# EAGLE design Button_Sequencer (EAGLE 9.3.0)
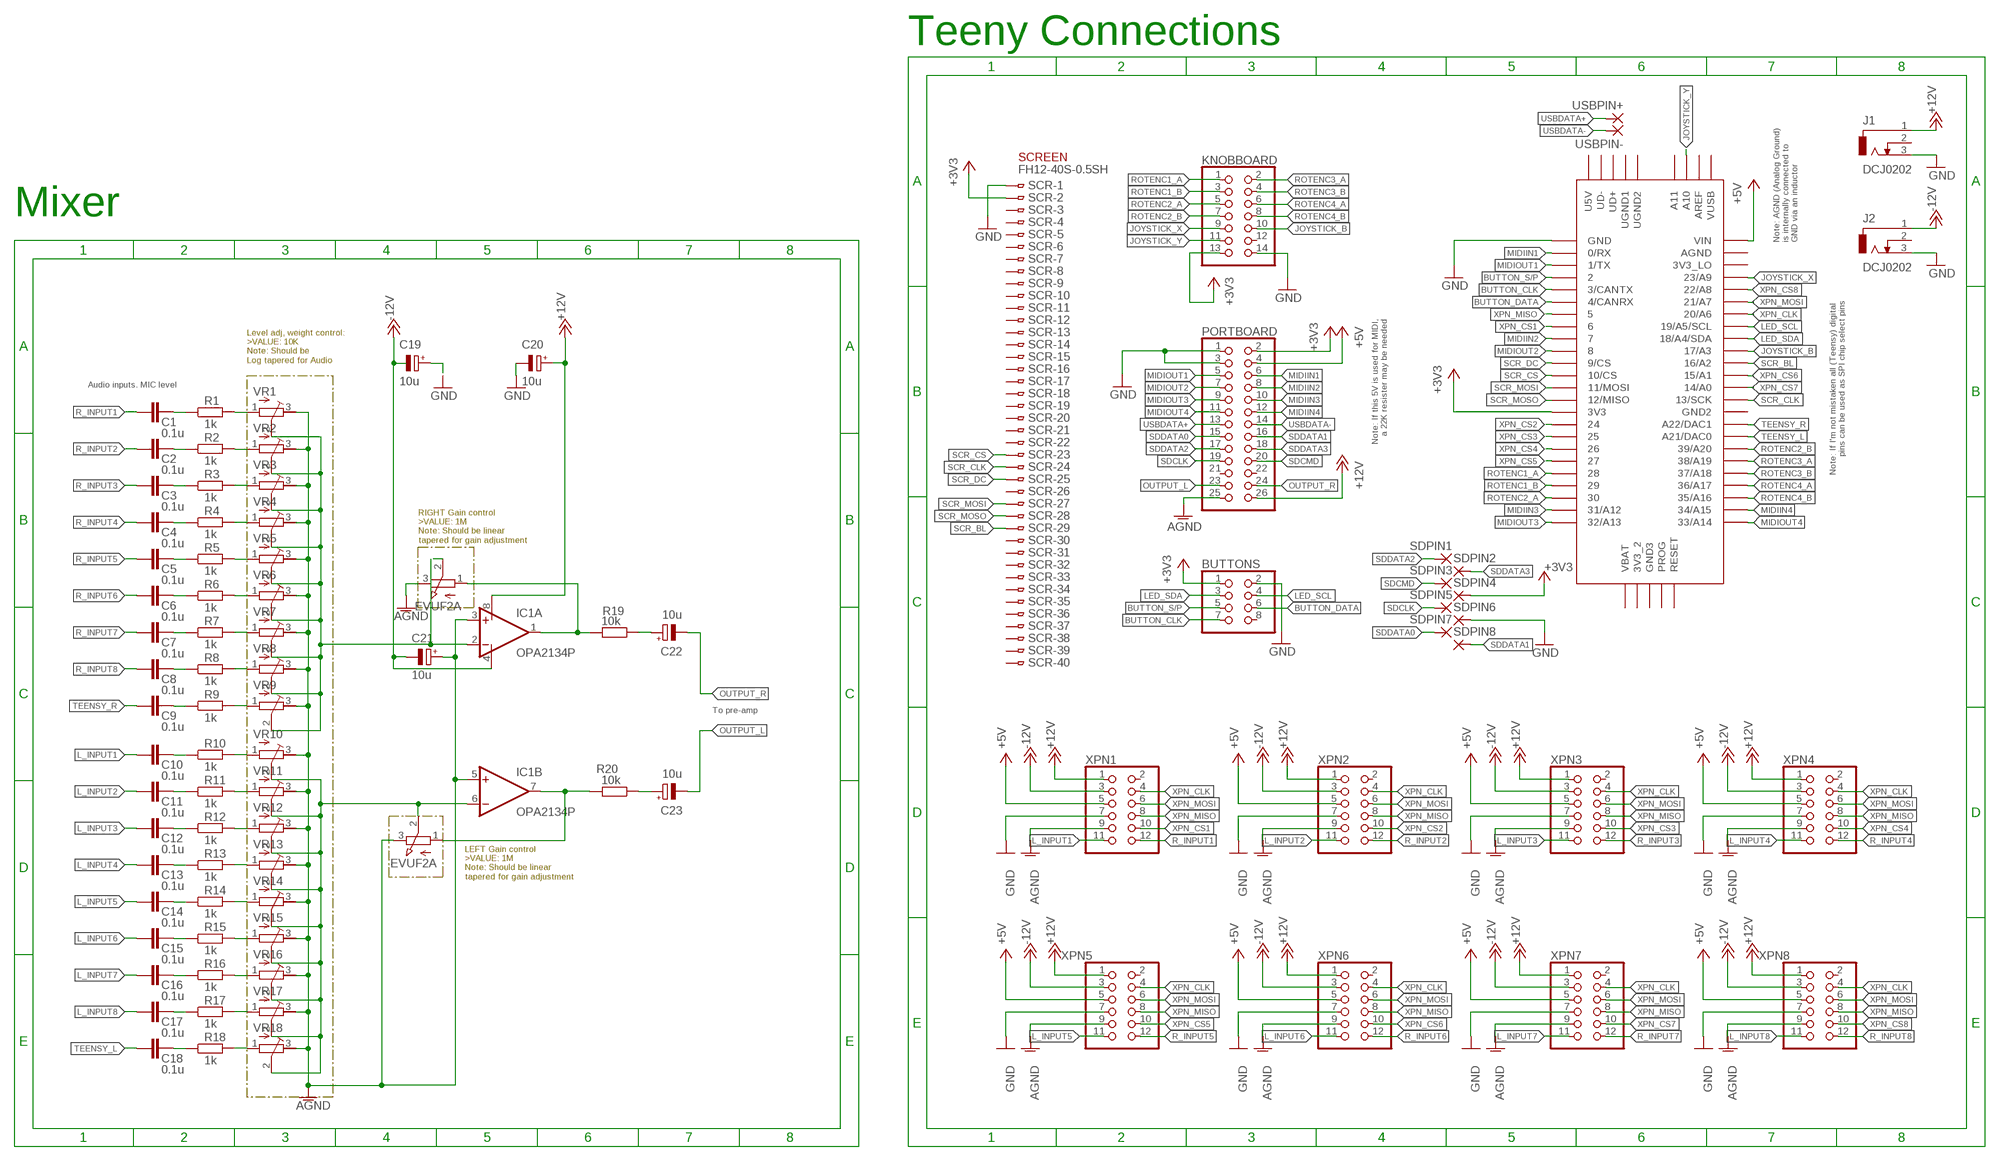
[diagram p0: schematic, sheet 1]

## Parts
BUTTONS  PINHD-2X4  [2X04]
C1  0.1u  C-EU025-030X050  [C025-030X050]
C2  0.1u  C-EU025-030X050  [C025-030X050]
C3  0.1u  C-EU025-030X050  [C025-030X050]
C4  0.1u  C-EU025-030X050  [C025-030X050]
C5  0.1u  C-EU025-030X050  [C025-030X050]
C6  0.1u  C-EU025-030X050  [C025-030X050]
C7  0.1u  C-EU025-030X050  [C025-030X050]
C8  0.1u  C-EU025-030X050  [C025-030X050]
C9  0.1u  C-EU025-030X050  [C025-030X050]
C10  0.1u  C-EU025-030X050  [C025-030X050]
C11  0.1u  C-EU025-030X050  [C025-030X050]
C12  0.1u  C-EU025-030X050  [C025-030X050]
C13  0.1u  C-EU025-030X050  [C025-030X050]
C14  0.1u  C-EU025-030X050  [C025-030X050]
C15  0.1u  C-EU025-030X050  [C025-030X050]
C16  0.1u  C-EU025-030X050  [C025-030X050]
C17  0.1u  C-EU025-030X050  [C025-030X050]
C18  0.1u  C-EU025-030X050  [C025-030X050]
C19  10u  CPOL-EUE5-10.5  [E5-10,5]
C20  10u  CPOL-EUE5-10.5  [E5-10,5]
C21  10u  CPOL-EUE5-10.5  [E5-10,5]
C22  10u  CPOL-EUE5-10.5  [E5-10,5]
C23  10u  CPOL-EUE5-10.5  [E5-10,5]
IC1  OPA2134P  [DIL08]
J1  DCJ0202  [DCJ0202]
J2  DCJ0202  [DCJ0202]
KNOBBOARD  PINHD-2X7  [2X07]
PORTBOARD  PINHD-2X13  [2X13]
R1  1k  R-EU_R0805  [R0805]
R2  1k  R-EU_R0805  [R0805]
R3  1k  R-EU_R0805  [R0805]
R4  1k  R-EU_R0805  [R0805]
R5  1k  R-EU_R0805  [R0805]
R6  1k  R-EU_R0805  [R0805]
R7  1k  R-EU_R0805  [R0805]
R8  1k  R-EU_R0805  [R0805]
R9  1k  R-EU_R0805  [R0805]
R10  1k  R-EU_R0805  [R0805]
R11  1k  R-EU_R0805  [R0805]
R12  1k  R-EU_R0805  [R0805]
R13  1k  R-EU_R0805  [R0805]
R14  1k  R-EU_R0805  [R0805]
R15  1k  R-EU_R0805  [R0805]
R16  1k  R-EU_R0805  [R0805]
R17  1k  R-EU_R0805  [R0805]
R18  1k  R-EU_R0805  [R0805]
R19  10k  R-EU_R0805  [R0805]
R20  10k  R-EU_R0805  [R0805]
SCR  FH12-40S-0.5SH  [FH12-40S-0.5SH]
SDPIN1  1,6/0,8  [1,6/0,8]
SDPIN2  1,6/0,8  [1,6/0,8]
SDPIN3  1,6/0,8  [1,6/0,8]
SDPIN4  1,6/0,8  [1,6/0,8]
SDPIN5  1,6/0,8  [1,6/0,8]
SDPIN6  1,6/0,8  [1,6/0,8]
SDPIN7  1,6/0,8  [1,6/0,8]
SDPIN8  1,6/0,8  [1,6/0,8]
TEENSY_3.6  TEENSY_3.5/3.6  [TEENSY_3.5/3.6]
USBPIN+  1,6/0,8  [1,6/0,8]
USBPIN-  1,6/0,8  [1,6/0,8]
VR1  R-TRIMM3339P  [RTRIM3339P]
VR2  R-TRIMM3339P  [RTRIM3339P]
VR3  R-TRIMM3339P  [RTRIM3339P]
VR4  R-TRIMM3339P  [RTRIM3339P]
VR5  R-TRIMM3339P  [RTRIM3339P]
VR6  R-TRIMM3339P  [RTRIM3339P]
VR7  R-TRIMM3339P  [RTRIM3339P]
VR8  R-TRIMM3339P  [RTRIM3339P]
VR9  R-TRIMM3339P  [RTRIM3339P]
VR10  R-TRIMM3339P  [RTRIM3339P]
VR11  R-TRIMM3339P  [RTRIM3339P]
VR12  R-TRIMM3339P  [RTRIM3339P]
VR13  R-TRIMM3339P  [RTRIM3339P]
VR14  R-TRIMM3339P  [RTRIM3339P]
VR15  R-TRIMM3339P  [RTRIM3339P]
VR16  R-TRIMM3339P  [RTRIM3339P]
VR17  R-TRIMM3339P  [RTRIM3339P]
VR18  R-TRIMM3339P  [RTRIM3339P]
VR19  EVUF2A  [EVUF]
VR20  EVUF2A  [EVUF]
XPN1  PINHD-2X6  [2X06]
XPN2  PINHD-2X6  [2X06]
XPN3  PINHD-2X6  [2X06]
XPN4  PINHD-2X6  [2X06]
XPN5  PINHD-2X6  [2X06]
XPN6  PINHD-2X6  [2X06]
XPN7  PINHD-2X6  [2X06]
XPN8  PINHD-2X6  [2X06]

## Nets
+3V3: BUTTONS.1 KNOBBOARD.13 PORTBOARD.2 SCR.2 SDPIN4.1(P) TEENSY_3.6.3V3
+5V: PORTBOARD.4 TEENSY_3.6.VIN XPN1.5 XPN2.5 XPN3.5 XPN4.5 XPN5.5 XPN6.5 XPN7.5 XPN8.5
+12V: C20.+ IC1.8(P:V+) J1.1 PORTBOARD.26 XPN1.1 XPN2.1 XPN3.1 XPN4.1 XPN5.1 XPN6.1 XPN7.1 XPN8.1
-12V: C19.- C21.- IC1.4(P:V-) J2.1 XPN1.3 XPN2.3 XPN3.3 XPN4.3 XPN5.3 XPN6.3 XPN7.3 XPN8.3
AGND: C21.+ IC1.3(A:+IN) IC1.5(B:+IN) PORTBOARD.25 VR1.3(E) VR2.3(E) VR3.3(E) VR4.3(E) VR5.3(E) VR6.3(E) VR7.3(E) VR8.3(E) VR9.3(E) VR10.3(E) VR11.3(E) VR12.3(E) VR13.3(E) VR14.3(E) VR15.3(E) VR16.3(E) VR17.3(E) VR18.3(E) VR19.3(E) VR20.3(E) XPN1.9 XPN2.9 XPN3.9 XPN4.9 XPN5.9 XPN6.9 XPN7.9 XPN8.9
BUTTON_CLK: BUTTONS.7 TEENSY_3.6.3/CANTX
BUTTON_DATA: BUTTONS.6 TEENSY_3.6.4/CANRX
BUTTON_S/P: BUTTONS.5 TEENSY_3.6.2
GND: BUTTONS.2 C19.+ C20.- J1.3 J2.3 KNOBBOARD.14 PORTBOARD.1 PORTBOARD.3 SCR.1 SDPIN6.1(P) TEENSY_3.6.GND XPN1.7 XPN2.7 XPN3.7 XPN4.7 XPN5.7 XPN6.7 XPN7.7 XPN8.7
JOYSTICK_B: KNOBBOARD.10 TEENSY_3.6.17/A3
JOYSTICK_X: KNOBBOARD.9 TEENSY_3.6.23/A9
JOYSTICK_Y: KNOBBOARD.11 TEENSY_3.6.A10
L_INPUT1: C10.2 XPN1.11
L_INPUT2: C11.2 XPN2.11
L_INPUT3: C12.2 XPN3.11
L_INPUT4: C13.2 XPN4.11
L_INPUT5: C14.2 XPN5.11
L_INPUT6: C15.2 XPN6.11
L_INPUT7: C16.2 XPN7.11
L_INPUT8: C17.2 XPN8.11
L_OP_IN: IC1.6(B:-IN) VR10.2(S) VR11.2(S) VR12.2(S) VR13.2(S) VR14.2(S) VR15.2(S) VR16.2(S) VR17.2(S) VR18.2(S) VR20.2(S)
LED_SCL: BUTTONS.4 TEENSY_3.6.19/A5/SCL
LED_SDA: BUTTONS.3 TEENSY_3.6.18/A4/SDA
LEFT_OP_OUT: IC1.7(B:OUT) R20.2 VR20.1(A)
MIDIIN1: PORTBOARD.6 TEENSY_3.6.0/RX
MIDIIN2: PORTBOARD.8 TEENSY_3.6.7
MIDIIN3: PORTBOARD.10 TEENSY_3.6.31/A12
MIDIIN4: PORTBOARD.12 TEENSY_3.6.34/A15
MIDIOUT1: PORTBOARD.5 TEENSY_3.6.1/TX
MIDIOUT2: PORTBOARD.7 TEENSY_3.6.8
MIDIOUT3: PORTBOARD.9 TEENSY_3.6.32/A13
MIDIOUT4: PORTBOARD.11 TEENSY_3.6.33/A14
N$1: C4.1 R4.1
N$2: C22.+ R19.1
N$3: C1.1 R1.1
N$4: C2.1 R2.1
N$5: C3.1 R3.1
N$6: C9.1 R9.1
N$7: R9.2 VR9.1(A)
N$8: C10.1 R10.1
N$9: R10.2 VR10.1(A)
N$10: R3.2 VR3.1(A)
N$11: C11.1 R11.1
N$13: R1.2 VR1.1(A)
N$14: R4.2 VR4.1(A)
N$15: C12.1 R12.1
N$16: C13.1 R13.1
N$17: R13.2 VR13.1(A)
N$18: R2.2 VR2.1(A)
N$20: C23.+ R20.1
N$21: R11.2 VR11.1(A)
N$23: R12.2 VR12.1(A)
N$25: C5.1 R5.1
N$26: C6.1 R6.1
N$27: C7.1 R7.1
N$28: R7.2 VR7.1(A)
N$29: R5.2 VR5.1(A)
N$30: R6.2 VR6.1(A)
N$31: C8.1 R8.1
N$32: R8.2 VR8.1(A)
N$35: C14.1 R14.1
N$36: R14.2 VR14.1(A)
N$39: C15.1 R15.1
N$40: C16.1 R16.1
N$41: C17.1 R17.1
N$42: R17.2 VR17.1(A)
N$43: R15.2 VR15.1(A)
N$44: R16.2 VR16.1(A)
N$45: C18.1 R18.1
N$46: R18.2 VR18.1(A)
OUTPUT_L: C23.- PORTBOARD.23
OUTPUT_R: C22.- PORTBOARD.24
R_INPUT1: C1.2 XPN1.12
R_INPUT2: C2.2 XPN2.12
R_INPUT3: C3.2 XPN3.12
R_INPUT4: C4.2 XPN4.12
R_INPUT5: C5.2 XPN5.12
R_INPUT6: C6.2 XPN6.12
R_INPUT7: C7.2 XPN7.12
R_INPUT8: C8.2 XPN8.12
R_OP_IN: IC1.2(A:-IN) VR1.2(S) VR2.2(S) VR3.2(S) VR4.2(S) VR5.2(S) VR6.2(S) VR7.2(S) VR8.2(S) VR9.2(S) VR19.2(S)
RIGHT_OP_OUT: IC1.1(A:OUT) R19.2 VR19.1(A)
ROTENC1_A: KNOBBOARD.1 TEENSY_3.6.28
ROTENC1_B: KNOBBOARD.3 TEENSY_3.6.29
ROTENC2_A: KNOBBOARD.5 TEENSY_3.6.30
ROTENC2_B: KNOBBOARD.7 TEENSY_3.6.39/A20
ROTENC3_A: KNOBBOARD.2 TEENSY_3.6.38/A19
ROTENC3_B: KNOBBOARD.4 TEENSY_3.6.37/A18
ROTENC4_A: KNOBBOARD.6 TEENSY_3.6.36/A17
ROTENC4_B: KNOBBOARD.8 TEENSY_3.6.35/A16
SCR_BL: SCR.29 TEENSY_3.6.16/A2
SCR_CLK: SCR.24 TEENSY_3.6.13/SCK
SCR_CS: SCR.23 TEENSY_3.6.10/CS
SCR_DC: SCR.25 TEENSY_3.6.9/CS
SCR_MOSI: SCR.27 TEENSY_3.6.11/MOSI
SCR_MOSO: SCR.28 TEENSY_3.6.12/MISO
SDCLK: PORTBOARD.19 SDPIN5.1(P)
SDCMD: PORTBOARD.20 SDPIN3.1(P)
SDDATA0: PORTBOARD.15 SDPIN7.1(P)
SDDATA1: PORTBOARD.16 SDPIN8.1(P)
SDDATA2: PORTBOARD.17 SDPIN1.1(P)
SDDATA3: PORTBOARD.18 SDPIN2.1(P)
TEENSY_L: C18.2 TEENSY_3.6.21/DAC0(A21/DAC0)
TEENSY_R: C9.2 TEENSY_3.6.A22/DAC1
USBDATA+: PORTBOARD.13 USBPIN+.1(P)
USBDATA-: PORTBOARD.14 USBPIN-.1(P)
XPN_CLK: TEENSY_3.6.20/A6 XPN1.4 XPN2.4 XPN3.4 XPN4.4 XPN5.4 XPN6.4 XPN7.4 XPN8.4
XPN_CS1: TEENSY_3.6.6 XPN1.10
XPN_CS2: TEENSY_3.6.24 XPN2.10
XPN_CS3: TEENSY_3.6.25 XPN3.10
XPN_CS4: TEENSY_3.6.26 XPN4.10
XPN_CS5: TEENSY_3.6.27 XPN5.10
XPN_CS6: TEENSY_3.6.15/A1 XPN6.10
XPN_CS7: TEENSY_3.6.14/A0 XPN7.10
XPN_CS8: TEENSY_3.6.22/A8 XPN8.10
XPN_MISO: TEENSY_3.6.5 XPN1.8 XPN2.8 XPN3.8 XPN4.8 XPN5.8 XPN6.8 XPN7.8 XPN8.8
XPN_MOSI: TEENSY_3.6.21/A7 XPN1.6 XPN2.6 XPN3.6 XPN4.6 XPN5.6 XPN6.6 XPN7.6 XPN8.6
Unconnected: BUTTONS.8 J1.2 J2.2 KNOBBOARD.12 PORTBOARD.21 PORTBOARD.22 SCR.3 SCR.4 SCR.5 SCR.6 SCR.7 SCR.8 SCR.9 SCR.10 SCR.11 SCR.12 SCR.13 SCR.14 SCR.15 SCR.16 SCR.17 SCR.18 SCR.19 SCR.20 SCR.21 SCR.22 SCR.26 SCR.30 SCR.31 SCR.32 SCR.33 SCR.34 SCR.35 SCR.36 SCR.37 SCR.38 SCR.39 SCR.40 TEENSY_3.6.3V3_2 TEENSY_3.6.3V3_LO TEENSY_3.6.A11 TEENSY_3.6.AGND TEENSY_3.6.AREF TEENSY_3.6.GND2 TEENSY_3.6.GND3 TEENSY_3.6.PROG TEENSY_3.6.RESET TEENSY_3.6.U5V TEENSY_3.6.UD+ TEENSY_3.6.UD- TEENSY_3.6.UGND1 TEENSY_3.6.UGND2 TEENSY_3.6.VBAT TEENSY_3.6.VUSB XPN1.2 XPN2.2 XPN3.2 XPN4.2 XPN5.2 XPN6.2 XPN7.2 XPN8.2

## Notes on the sheet
- Teeny Connections
- SCREEN
- Mixer
- Note: AGND (Analog Ground) 
  is internally connected to 
  GND via an inductor
- Note: If I'm not mistaken all (Teensy) digital 
  pins can be used as SPI chip select pins
- Note: If this 5V is used for MIDI,
  a 22K resister may be needed
- Level adj, weight control:
  >VALUE: 10K
  Note: Should be
  Log tapered for Audio
- Audio inputs. MIC level
- RIGHT Gain control
  >VALUE: 1M
  Note: Should be linear
  tapered for gain adjustment
- To pre-amp
- LEFT Gain control
  >VALUE: 1M
  Note: Should be linear
  tapered for gain adjustment

## Library data of the parts
BUTTONS = pinhead:PINHD-2X4: PIN HEADER
C1-C18 = rcl:C-EU: CAPACITOR, European symbol; SPICEPREFIX: C
C19-C23 = rcl:CPOL-EU: POLARIZED CAPACITOR, European symbol; SPICEPREFIX: C
IC1 = linear:OPA2134: SoundPLUS (TM) High Performance AUDIO OPERATIONAL AMPLIFIERS Source: http://focus.ti.com/lit/ds/sbos058/sbos058.pdf
J1 J2 = con-jack:DCJ0202: DC POWER JACK Source: DCJ0202.pdf; OC_FARNELL: unknown; OC_NEWARK: unknown
KNOBBOARD = pinhead:PINHD-2X7: PIN HEADER
PORTBOARD = pinhead:PINHD-2X13: PIN HEADER
R1-R20 = rcl:R-EU_: RESISTOR, European symbol; SPICEPREFIX: R
SCR = con-hirose:FH12-40S-0.5S: 0.5mm Pitch Connectors For FPC/FFC Source: Data sheet <http://www.hirose.co.jp/cataloge_hp/e58605370.pdf>; MPN: FH12-40S-0.5SH(55); OC_FARNELL: 1324556; OC_NEWARK: 34M6178
SDPIN1-SDPIN8 USBPIN+ USBPIN- = wirepad:1,6/0,8: THROUGH-HOLE PAD
TEENSY_3.6 = Teensy356:TEENSY_3.5/3.6
VR1-VR18 = rcl:R-TRIMM: Trimm resistor; SPICEMODEL: X; SPICEPREFIXL: POT
VR19 VR20 = pot:EVU: 9 mm Square Rotary Potentiometers Source: Panasonic
XPN1-XPN8 = pinhead:PINHD-2X6: PIN HEADER

## Board
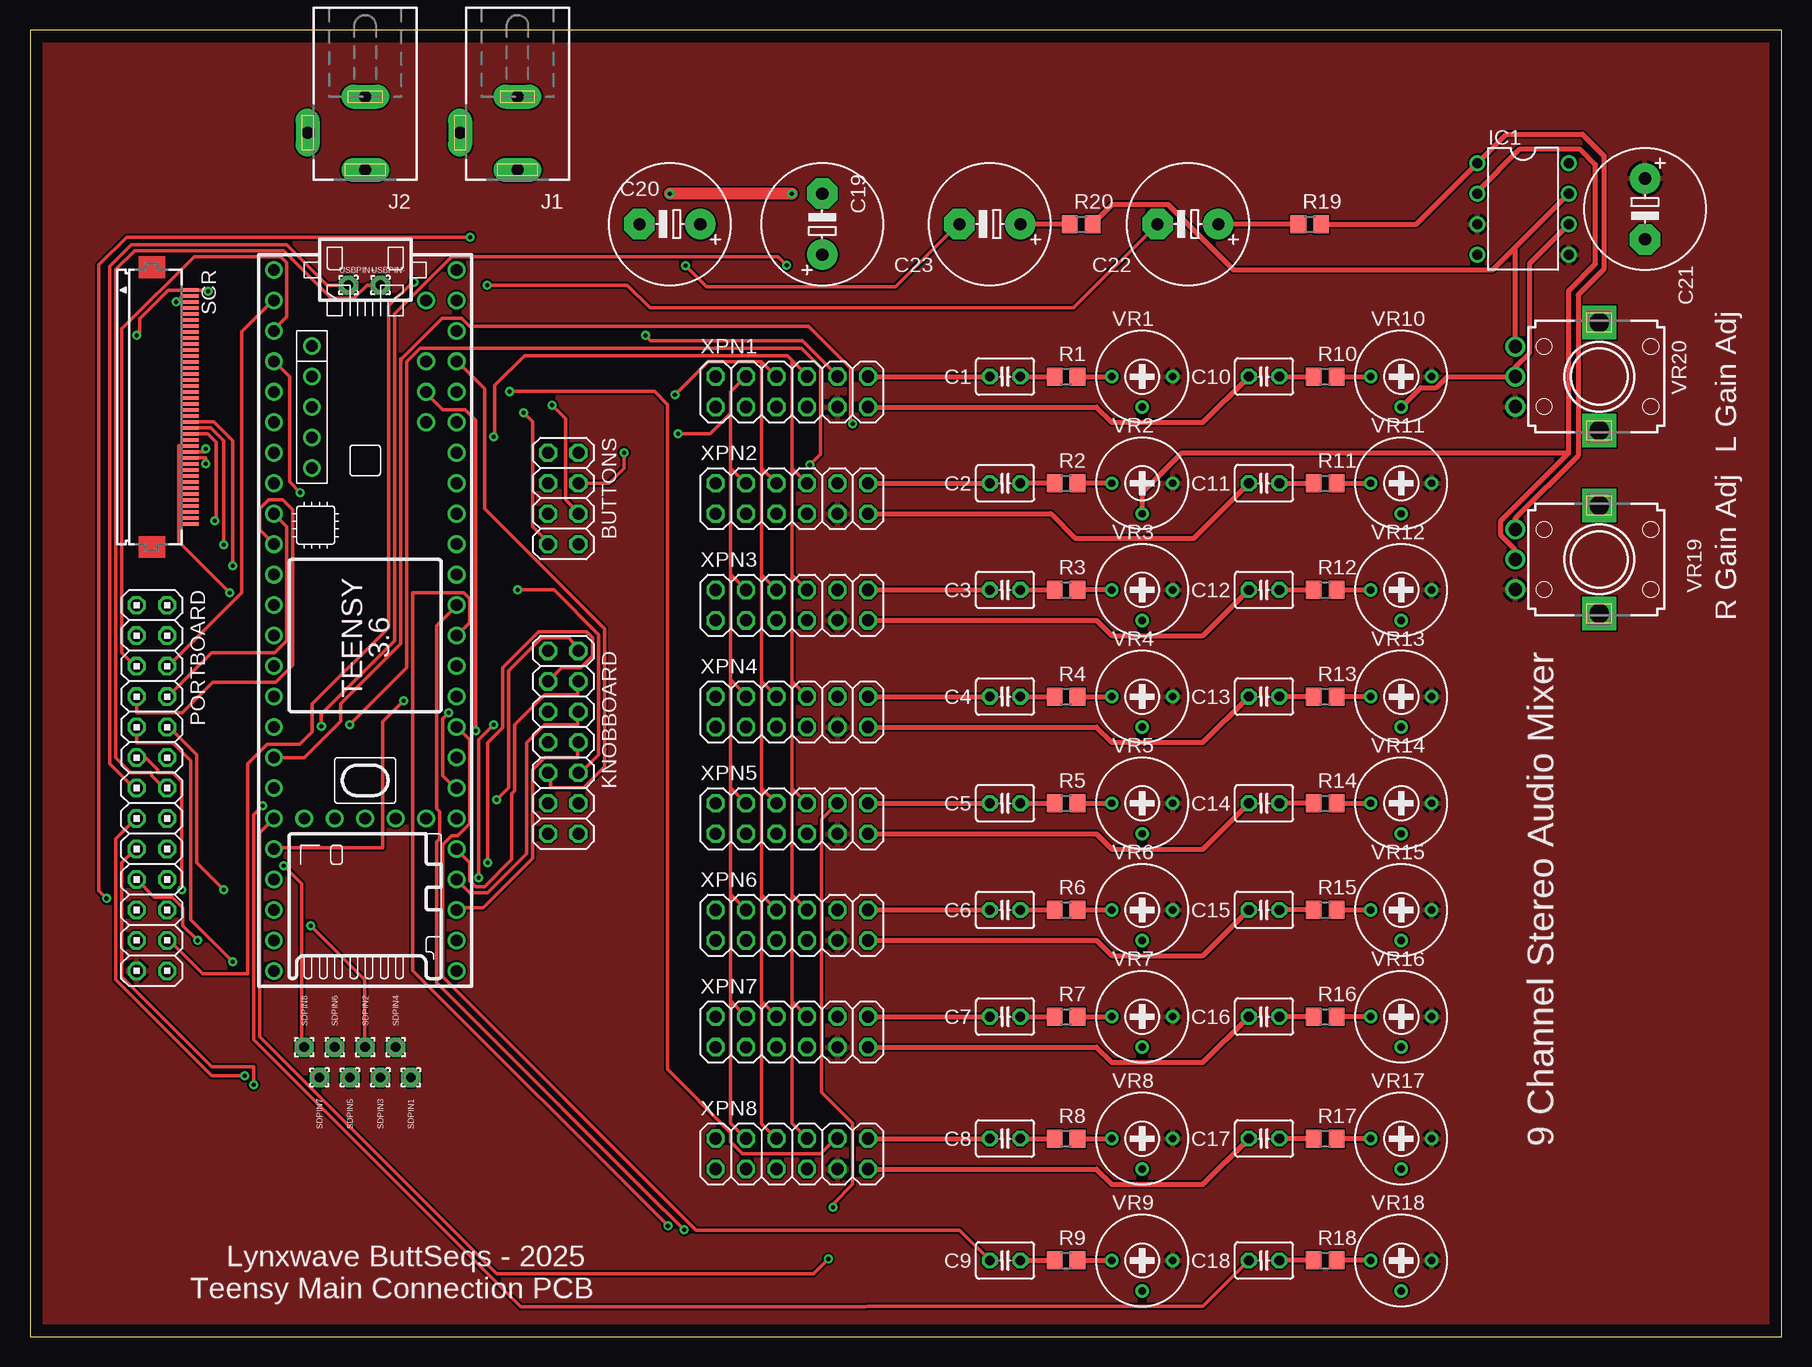
[diagram p1: board, top side]
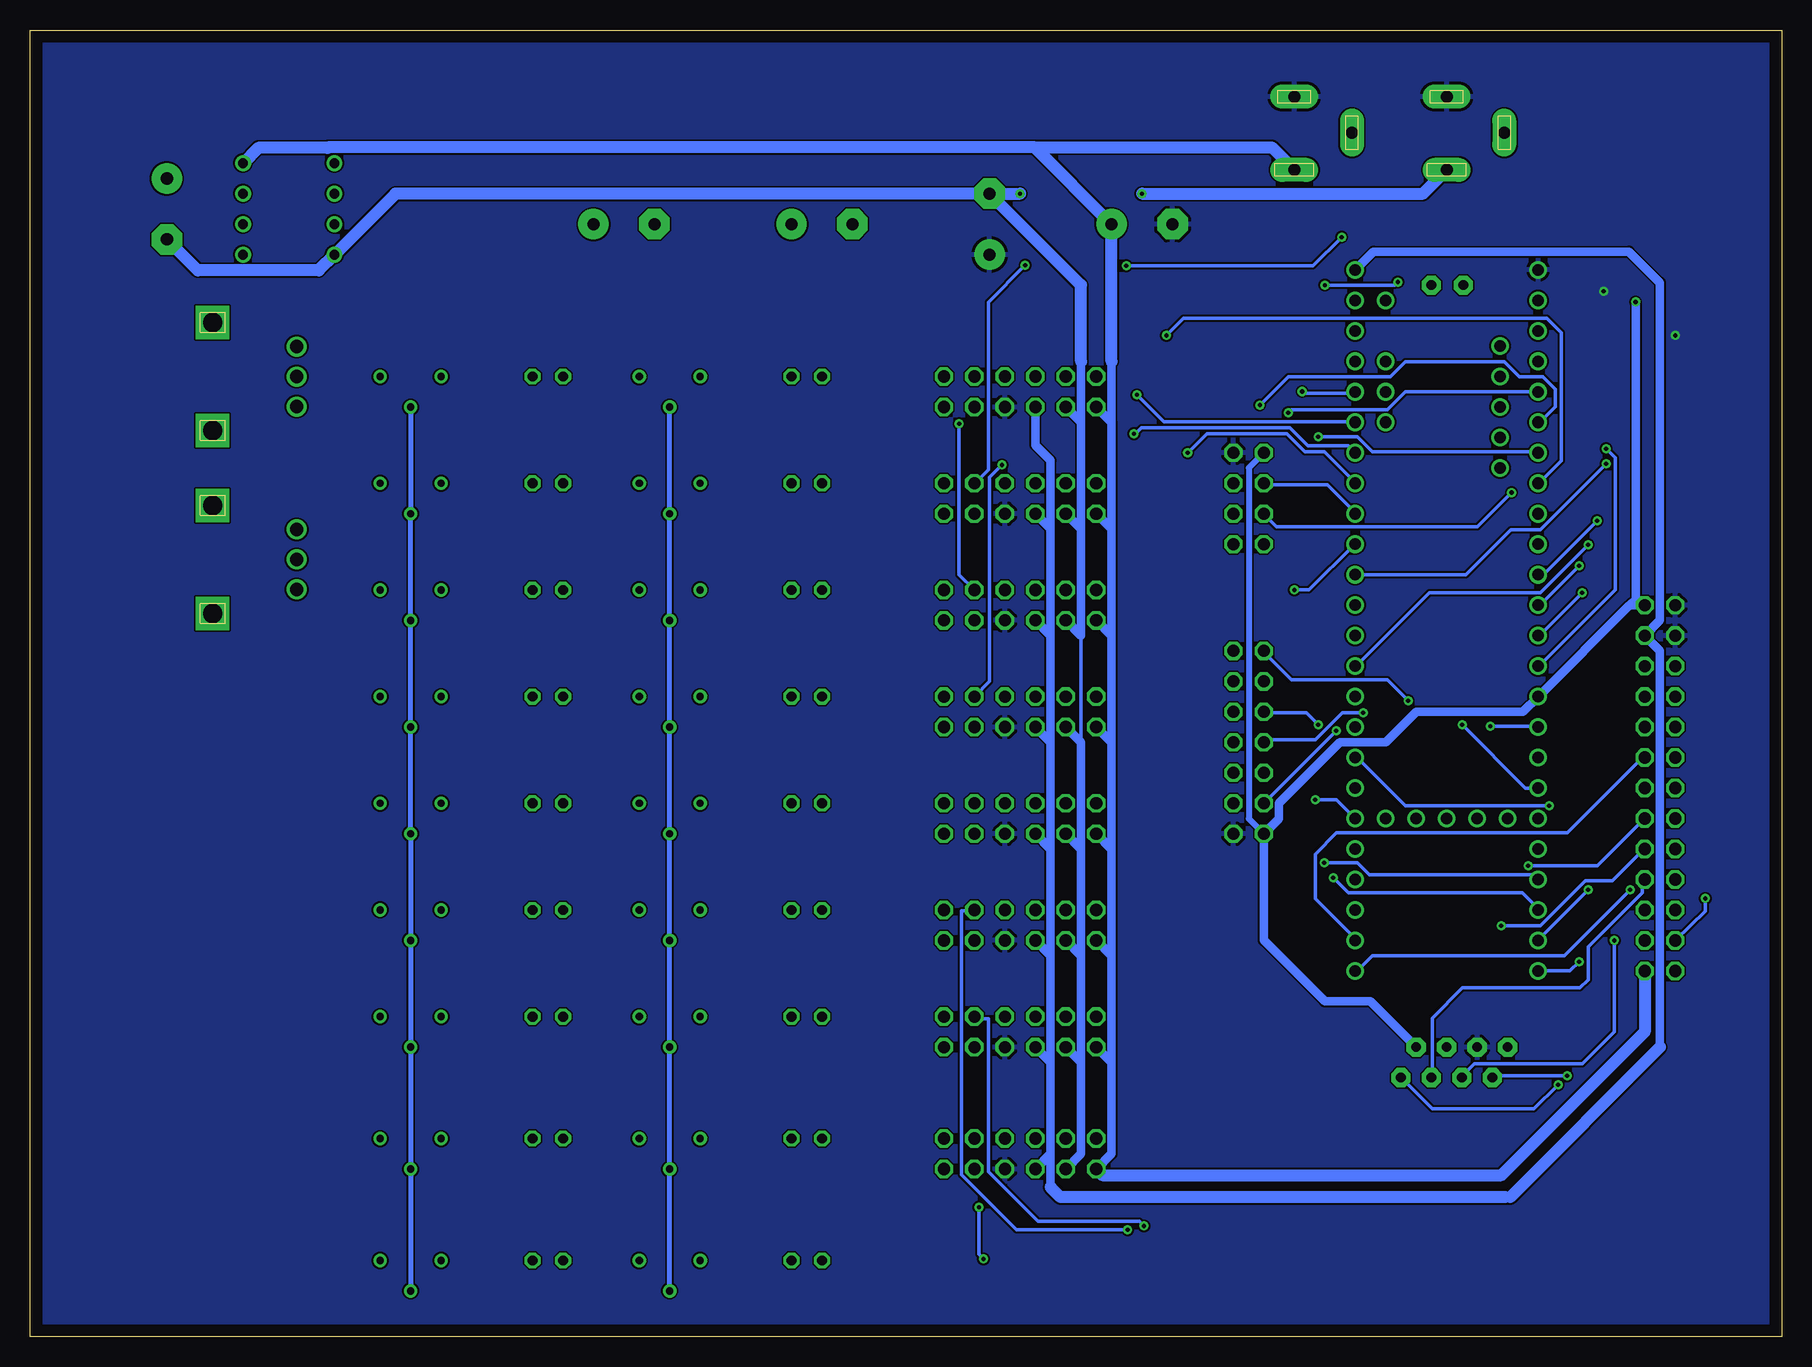
[diagram p2: board, bottom side, seen from below]

Size 146.03 x 108.89 mm. Coordinates in mm from the lower left corner, seen from the top.
Outline: 0,0 146.03,0 146.03,108.89 0,108.89 0,0
Copper layers (1*16): Top 0.035mm / dielectric 1.5mm / Bottom 0.035mm
Design rules "default *": minimum track width 0.3mm, minimum drill 0.35mm, track to track 6mil, track to pad 6mil, pad to pad 6mil, via to via 6mil, smd to smd 6mil, copper to edge 40mil, drill to drill 6mil, minimum pad ring 10mil, minimum via ring 8mil, stop-mask expansion 4mil, vias tented up to drill 0mil, thermal gap 10mil

### Footprints (pad centres in the part's own frame; a part is rotated, then mirrored left to right if it is on the bottom)
2X04 = drill 1.016 octagon: 1 -3.81,-1.27; 2 -3.81,1.27; 3 -1.27,-1.27; 4 -1.27,1.27; 5 1.27,-1.27; 6 1.27,1.27; 7 3.81,-1.27; 8 3.81,1.27
C025-030X050 = drill 0.813 octagon: 1 -1.27,0; 2 1.27,0
E5-10,5 = drill 1.016 pad 2.54: + -2.54,0 | drill 1.016 pad 2.54 octagon: - 2.54,0
DIL08 = drill 0.813 pad 1.27: 1 -3.81,-3.81; 2 -1.27,-3.81; 3 1.27,-3.81; 4 3.81,-3.81; 5 3.81,3.81; 6 1.27,3.81; 7 -1.27,3.81; 8 -3.81,3.81
DCJ0202 = drill 1 pad 2 long: 1 0,3.1; 2 4.8,0; 3 0,-3
2X07 = drill 1.016 octagon: 1 -7.62,-1.27; 2 -7.62,1.27; 3 -5.08,-1.27; 4 -5.08,1.27; 5 -2.54,-1.27; 6 -2.54,1.27; 7 0,-1.27; 8 0,1.27; 9 2.54,-1.27; 10 2.54,1.27; 11 5.08,-1.27; 12 5.08,1.27; 13 7.62,-1.27; 14 7.62,1.27
2X13 = drill 1.016 octagon: 1 -15.24,-1.27; 2 -15.24,1.27; 3 -12.7,-1.27; 4 -12.7,1.27; 5 -10.16,-1.27; 6 -10.16,1.27; 7 -7.62,-1.27; 8 -7.62,1.27; 9 -5.08,-1.27; 10 -5.08,1.27; 11 -2.54,-1.27; 12 -2.54,1.27; 13 0,-1.27; 14 0,1.27; 15 2.54,-1.27; 16 2.54,1.27; 17 5.08,-1.27; 18 5.08,1.27; 19 7.62,-1.27; 20 7.62,1.27; 21 10.16,-1.27; 22 10.16,1.27; 23 12.7,-1.27; 24 12.7,1.27; 25 15.24,-1.27; 26 15.24,1.27
R0805 = smd 1.3 x 1.5: 1 -0.95,0; 2 0.95,0
FH12-40S-0.5SH = smd 0.3 x 1.3: 1 -9.75,3.25; 2 -9.25,3.25; 3 -8.75,3.25; 4 -8.25,3.25; 5 -7.75,3.25; 6 -7.25,3.25; 7 -6.75,3.25; 8 -6.25,3.25; 9 -5.75,3.25; 10 -5.25,3.25; 11 -4.75,3.25; 12 -4.25,3.25; 13 -3.75,3.25; 14 -3.25,3.25; 15 -2.75,3.25; 16 -2.25,3.25; 17 -1.75,3.25; 18 -1.25,3.25; 19 -0.75,3.25; 20 -0.25,3.25; 21 0.25,3.25; 22 0.75,3.25; 23 1.25,3.25; 24 1.75,3.25; 25 2.25,3.25; 26 2.75,3.25; 27 3.25,3.25; 28 3.75,3.25; 29 4.25,3.25; 30 4.75,3.25; 31 5.25,3.25; 32 5.75,3.25; 33 6.25,3.25; 34 6.75,3.25; 35 7.25,3.25; 36 7.75,3.25; 37 8.25,3.25; 38 8.75,3.25; 39 9.25,3.25; 40 9.75,3.25
1,6/0,8 = drill 0.813 pad 1.6 octagon: 1 0,0
TEENSY_3.5/3.6 = drill 0.965: 0/RX -25.4,-7.62; 1/TX -22.86,-7.62; 2 -20.32,-7.62; 3/CANTX -17.78,-7.62; 3V3 7.62,-7.62; 3V3_2 17.78,-2.54; 3V3_LO -22.86,7.62; 4/CANRX -15.24,-7.62; 5 -12.7,-7.62; 6 -10.16,-7.62; 7 -7.62,-7.62; 8 -5.08,-7.62; 9/CS -2.54,-7.62; 10/CS 0,-7.62; 11/MOSI 2.54,-7.62; 12/MISO 5.08,-7.62; 13/SCK 5.08,7.62; 14/A0 2.54,7.62; 15/A1 0,7.62; 16/A2 -2.54,7.62; 17/A3 -5.08,7.62; 18/A4/SDA -7.62,7.62; 19/A5/SCL -10.16,7.62; 20/A6 -12.7,7.62; 21/A7 -15.24,7.62; 21/DAC0 12.7,7.62; 22/A8 -17.78,7.62; 23/A9 -20.32,7.62; 24 10.16,-7.62; 25 12.7,-7.62; 26 15.24,-7.62; 27 17.78,-7.62; 28 20.32,-7.62; 29 22.86,-7.62; 30 25.4,-7.62; 31/A12 27.94,-7.62; 32/A13 30.48,-7.62; 33/A14 30.48,7.62; 34/A15 27.94,7.62; 35/A16 25.4,7.62; 36/A17 22.86,7.62; 37/A18 20.32,7.62; 38/A19 17.78,7.62; 39/A20 15.24,7.62; A10 -17.78,5.08; A11 -15.24,5.08; A22/DAC1 10.16,7.62; AGND -25.4,7.62; AREF -20.32,5.08; GND -27.94,-7.62; GND2 7.62,7.62; GND3 17.78,0; PROG 17.78,2.54; RESET 17.78,5.08; U5V -21.59,-4.445; UD+ -16.51,-4.445; UD- -19.05,-4.445; UGND1 -13.97,-4.445; UGND2 -11.43,-4.445; VBAT 17.78,-5.08; VIN -27.94,7.62; VUSB -25.4,5.08
RTRIM3339P = drill 0.61: 1 -2.54,0; 2 0,-2.54; 3 2.54,0
EVUF = drill 1.1 pad 1.676: 1 -2.5,-7; 2 0,-7; 3 2.5,-7 | drill 1.6 pad 2.8 square: M1 4.5,0; M2 -4.5,0
2X06 = drill 1.016 octagon: 1 -6.35,-1.27; 2 -6.35,1.27; 3 -3.81,-1.27; 4 -3.81,1.27; 5 -1.27,-1.27; 6 -1.27,1.27; 7 1.27,-1.27; 8 1.27,1.27; 9 3.81,-1.27; 10 3.81,1.27; 11 6.35,-1.27; 12 6.35,1.27

### Placement (x,y rotation side)
BUTTONS  44.45,69.85 270 top
C1  81.28,80.01 180 top
C2  81.28,71.12 180 top
C3  81.28,62.23 180 top
C4  81.28,53.34 180 top
C5  81.28,44.45 180 top
C6  81.28,35.56 180 top
C7  81.28,26.67 180 top
C8  81.28,16.51 180 top
C9  81.28,6.35 180 top
C10  102.87,80.01 180 top
C11  102.87,71.12 180 top
C12  102.87,62.23 180 top
C13  102.87,53.34 180 top
C14  102.87,44.45 180 top
C15  102.87,35.56 180 top
C16  102.87,26.67 180 top
C17  102.87,16.51 180 top
C18  102.87,6.35 180 top
C19  66.04,92.71 90 top
C20  53.34,92.71 180 top
C21  134.62,93.98 270 top
C22  96.52,92.71 180 top
C23  80.01,92.71 180 top
IC1  124.46,93.98 270 top
J1  40.64,100.33 180 top
J2  27.94,100.33 180 top
KNOBBOARD  44.45,49.53 270 top
PORTBOARD  10.16,45.72 270 top
R1  86.36,80.01 0 top
R2  86.36,71.12 0 top
R3  86.36,62.23 0 top
R4  86.36,53.34 0 top
R5  86.36,44.45 0 top
R6  86.36,35.56 0 top
R7  86.36,26.67 0 top
R8  86.36,16.51 0 top
R9  86.36,6.35 0 top
R10  107.95,80.01 0 top
R11  107.95,71.12 0 top
R12  107.95,62.23 0 top
R13  107.95,53.34 0 top
R14  107.95,44.45 0 top
R15  107.95,35.56 0 top
R16  107.95,26.67 0 top
R17  107.95,16.51 0 top
R18  107.95,6.35 0 top
R19  106.68,92.71 0 top
R20  87.63,92.71 0 top
SCR  10.16,77.47 270 top
SDPIN1  31.75,21.59 270 top
SDPIN2  27.94,24.13 90 top
SDPIN3  29.21,21.59 270 top
SDPIN4  30.48,24.13 90 top
SDPIN5  26.67,21.59 270 top
SDPIN6  25.4,24.13 90 top
SDPIN7  24.13,21.59 270 top
SDPIN8  22.86,24.13 90 top
TEENSY_3.6  27.94,60.96 270 top
USBPIN+  26.54,87.63 0 top
USBPIN-  29.21,87.63 0 top
VR1  92.71,80.01 0 top
VR2  92.71,71.12 0 top
VR3  92.71,62.23 0 top
VR4  92.71,53.34 0 top
VR5  92.71,44.45 0 top
VR6  92.71,35.56 0 top
VR7  92.71,26.67 0 top
VR8  92.71,16.51 0 top
VR9  92.71,6.35 0 top
VR10  114.3,80.01 0 top
VR11  114.3,71.12 0 top
VR12  114.3,62.23 0 top
VR13  114.3,53.34 0 top
VR14  114.3,44.45 0 top
VR15  114.3,35.56 0 top
VR16  114.3,26.67 0 top
VR17  114.3,16.51 0 top
VR18  114.3,6.35 0 top
VR19  130.81,64.77 270 top
VR20  130.81,80.01 270 top
XPN1  63.5,78.74 0 top
XPN2  63.5,69.85 0 top
XPN3  63.5,60.96 0 top
XPN4  63.5,52.07 0 top
XPN5  63.5,43.18 0 top
XPN6  63.5,34.29 0 top
XPN7  63.5,25.4 0 top
XPN8  63.5,15.24 0 top

### Tracks (layer width: path | path; a pad name or v marks a point on that pad's centre or on a via)
+3V3  (via drill 0.35)
  Top 0.3: SCR.2 12.7,86.72 | 12.7,86.72 12.68,86.72 | 12.7,86.72 12.65,86.67 12.63,86.67 v12.19,86.23
  Bottom 0.5: BUTTONS.1 44.44,72.4 44.44,43.17 KNOBBOARD.13
  Bottom 0.7: SDPIN4.1 34.29,27.94 38.1,27.94 43.18,33.02 KNOBBOARD.13 41.91,43.18 41.91,44.45 36.83,49.53 33.02,49.53 30.48,52.07 21.59,52.07 TEENSY_3.6.3V3 12.7,60.96 | 12.7,60.96 PORTBOARD.2 | 12.7,60.96 12.19,61.47 v12.19,86.23
+5V
  Bottom 0.7: XPN8.5 60.96,15.24 | 60.96,15.24 60.96,22.86 | 60.96,22.86 60.96,31.75 | 60.96,31.75 60.96,40.64 | 60.96,40.64 60.96,49.53 | 60.96,49.53 60.96,58.42 | 60.96,58.42 60.96,67.31 | 60.96,67.31 60.96,73.03 62.23,74.3 XPN1.5 | XPN2.5 60.96,67.31 | XPN3.5 60.96,58.42 | XPN4.5 60.96,49.53 | XPN5.5 60.96,40.64 | XPN6.5 60.96,31.75 | XPN7.5 60.96,22.86 | TEENSY_3.6.VIN 34.04,90.42 12.76,90.42 10.16,87.83 10.16,59.69 PORTBOARD.4 10.16,57.15 10.16,24.13 | 60.96,12.46 60.96,15.24 | 22.65,11.64 24.13,11.64
  Bottom 1: 23.09,11.64 24.13,11.64 60.13,11.64 60.96,12.46 | 10.16,24.13 22.65,11.64
+12V
  Bottom 0.7: XPN1.1 55.88,76.2 | 55.88,76.2 55.88,67.31 | 55.88,67.31 55.88,58.42 | 55.88,58.42 55.88,49.53 | 55.88,49.53 55.88,40.64 | 55.88,40.64 55.88,31.75 | 55.88,31.75 55.88,22.86 | 55.88,22.86 55.88,15.24 XPN8.1 | XPN7.1 55.88,22.86 | XPN6.1 55.88,31.75 | XPN5.1 55.88,40.64 | XPN4.1 55.88,49.53 | XPN3.1 55.88,58.42 | XPN2.1 55.88,67.31 | 55.88,76.2 55.88,81.28
  Bottom 1: 62.27,99.1 C20.+ 55.88,81.28 | 62.27,99.1 121.19,99.1 121.24,99.06 127,99.06 IC1.8 | PORTBOARD.26 11.43,25.4 23.37,13.46 56.64,13.46 XPN8.1 | 62.27,99.1 42.51,99.1 J1.1
-12V  (via drill 0.35)
  Top 1: v63.5,95.25 v53.34,95.25
  Bottom 0.3: 58.42,58.42 58.42,49.53
  Bottom 0.7: XPN1.3 58.42,76.2 | 58.42,76.2 58.42,67.31 | 58.42,67.31 58.42,58.42 XPN3.3 | 58.42,40.64 58.42,49.53 XPN4.3 | 58.42,40.64 58.42,31.75 | 58.42,31.75 58.42,22.86 | 58.42,22.86 58.42,15.24 XPN8.3 | XPN7.3 58.42,22.86 | XPN6.3 58.42,31.75 | XPN5.3 58.42,40.64 | XPN2.3 58.42,67.31 | 58.42,76.2 58.42,81.28
  Bottom 1: C19.- 115.57,95.25 IC1.4 121.96,88.86 132.04,88.86 C21.- | 58.42,81.28 58.42,87.63 C19.- | C19.- v63.5,95.25 | v53.34,95.25 29.92,95.25 J2.1
AGND
  Top 0.3: 120.65,92.75 IC1.3
  pour Top: -5.08,-1.27 -5.08,111.76 149.86,111.76 149.86,-1.27
BUTTON_CLK  (via drill 0.35)
  Top 0.3: v41.15,77 41.9,76.25 41.9,67.5 43.15,66.25 BUTTONS.7
  Bottom 0.3: v41.15,77 40.9,77.25 32.9,77.25 31.4,78.75 20.4,78.75 TEENSY_3.6.3/CANTX
BUTTON_DATA  (via drill 0.35)
  Top 0.3: v43.52,77.64 44.65,76.5 44.65,69.75 45.65,68.75 BUTTONS.6
  Bottom 0.3: v43.52,77.64 41.15,80 32.65,80 31.4,81.25 23.15,81.25 21.9,80 19.93,80 18.9,78.97 18.9,77.5 20.15,76.25 TEENSY_3.6.4/CANRX
BUTTON_S/P  (via drill 0.35)
  Top 0.3: v22.53,70.34 21.64,71.23 21.64,80.01 20.4,81.25 TEENSY_3.6.2
  Bottom 0.3: v22.53,70.34 25.38,67.5 42.15,67.5 43.15,68.5 BUTTONS.5
GND  (via drill 0.35)
  Top 0.3: v14.86,87.12 14.76,87.22 SCR.1 11.53,87.22 9.15,84.83 9.15,83.69 v8.89,83.44
  pour Bottom: -2.54,110.49 147.32,110.49 147.32,-2.54 -2.54,-2.54
JOYSTICK_B  (via drill 0.35)
  Top 0.3: KNOBBOARD.10 45.9,47 47.4,48.5 47.4,58.5 43.67,62.23 v40.64,62.23
  Bottom 0.3: TEENSY_3.6.17/A3 35.65,66 39.42,62.23 v40.64,62.23
JOYSTICK_X
  Top 0.3: TEENSY_3.6.23/A9 35.65,81.25 37.9,79 37.9,69 47.9,59 47.9,47.5 46.15,45.75 43.4,45.75 43.4,46.75 KNOBBOARD.9
JOYSTICK_Y  (via drill 0.35)
  Top 0.3: v37.15,50.5 37.15,76.39 36.29,77.25 34.4,77.25 33.15,78.5 TEENSY_3.6.A10
  Bottom 0.3: v37.15,50.5 43.15,44.5 KNOBBOARD.11
L_INPUT1
  Top 0.42: XPN1.11 88.9,77.47 90.17,76.2 97.79,76.2 C10.2
L_INPUT2
  Top 0.42: XPN2.11 85.09,68.58 87.12,66.55 97.03,66.55 C11.2
L_INPUT3
  Top 0.42: XPN3.11 88.9,59.69 90.17,58.42 97.79,58.42 C12.2
L_INPUT4
  Top 0.42: XPN4.11 88.9,50.8 90.17,49.53 97.79,49.53 C13.2
L_INPUT5
  Top 0.42: XPN5.11 88.9,41.91 90.17,40.64 97.79,40.64 C14.2
L_INPUT6
  Top 0.42: XPN6.11 88.9,33.02 90.17,31.75 97.79,31.75 C15.2
L_INPUT7
  Top 0.42: XPN7.11 88.9,24.13 90.17,22.86 97.79,22.86 C16.2
L_INPUT8
  Top 0.42: XPN8.11 88.9,13.97 90.17,12.7 97.79,12.7 C17.2
L_OP_IN
  Top 0.42: IC1.6 125.01,89.45 125.01,82.01 123.81,80.81 VR20.2 118.14,80.01 117.22,79.09 115.92,79.09 VR10.2
  Bottom 0.42: VR10.2 VR11.2 VR12.2 VR13.2 VR14.2 VR15.2 VR16.2 VR17.2 VR18.2
LED_SCL  (via drill 0.35)
  Top 0.3: BUTTONS.4 48.26,71.12 49.53,72.39 v49.53,73.66
  Bottom 0.3: TEENSY_3.6.19/A5/SCL 35.65,71.25 38.15,73.75 39.74,73.75 41.25,75.26 47.93,75.26 v49.53,73.66
LED_SDA
  Bottom 0.3: TEENSY_3.6.18/A4/SDA 35.65,68.75 37.9,71 43.15,71 BUTTONS.3
LEFT_OP_OUT
  Top 0.42: VR20.1 123.81,90.79 | 123.81,90.79 IC1.7 | R20.2 90.23,94.36 94.87,94.36 100.33,88.9 121.92,88.9 123.81,90.79
MIDIIN1
  Top 0.3: TEENSY_3.6.0/RX 20.15,86.25 17.65,83.75 17.65,62 11.65,56 PORTBOARD.6
MIDIIN2
  Top 0.3: TEENSY_3.6.7 21.4,67.5 21.4,58 20.4,57 15.15,57 11.65,53.5 PORTBOARD.8
MIDIIN3  (via drill 0.35)
  Top 0.3: v16.15,37.25 13.9,39.5 13.9,48.5 11.65,50.75 PORTBOARD.10
  Bottom 0.3: v16.15,37.25 20.15,33.25 TEENSY_3.6.31/A12
MIDIIN4
  Bottom 0.3: TEENSY_3.6.34/A15 35.65,33.25 38.9,36.5 38.9,40.22 37.12,42 17.9,42 11.65,48.25 PORTBOARD.12
MIDIOUT1
  Top 0.3: TEENSY_3.6.1/TX 20.4,84 21.4,85 21.4,89.5 20.9,90 13.67,90 7.65,83.98 7.65,57 8.65,56 PORTBOARD.5
MIDIOUT2
  Top 0.3: TEENSY_3.6.8 20.15,66.25 19.15,67.25 19.15,69 19.9,69.75 21.05,69.75 21.9,68.91 21.9,55.94 20.48,54.52 15.22,54.52 12.7,52 8.9,52 8.9,53.25 PORTBOARD.7
MIDIOUT3  (via drill 0.35)
  Top 0.3: v16.9,31.25 13.4,34.75 13.4,48 11.9,49.5 8.9,49.5 8.9,50.75 PORTBOARD.9
  Bottom 0.3: TEENSY_3.6.32/A13 17.66,30.49 v16.9,31.25
MIDIOUT4  (via drill 0.35)
  Top 0.3: v12.65,37.25 12.65,46.25 11.9,47 10.65,47 10.65,47.25 9.65,48.25 PORTBOARD.11
  Bottom 0.3: v12.65,37.25 18.15,31.75 34.15,31.75 35.4,30.5 TEENSY_3.6.33/A14
N$1
  Top 0.42: C4.1 R4.1
N$2
  Top 0.42: R19.1 C22.+
N$3
  Top 0.42: C1.1 R1.1
N$4
  Top 0.42: R2.1 C2.1
N$5
  Top 0.42: C3.1 R3.1
N$6
  Top 0.42: C9.1 R9.1
N$7
  Top 0.42: R9.2 VR9.1
N$8
  Top 0.42: C10.1 R10.1
N$9
  Top 0.42: R10.2 VR10.1
N$10
  Top 0.42: VR3.1 R3.2
N$11
  Top 0.42: C11.1 R11.1
N$13
  Top 0.42: R1.2 VR1.1
N$14
  Top 0.42: R4.2 VR4.1
N$15
  Top 0.42: C12.1 R12.1
N$16
  Top 0.42: R13.1 C13.1
N$17
  Top 0.42: VR13.1 R13.2
N$18
  Top 0.42: VR2.1 R2.2
N$20
  Top 0.42: R20.1 C23.+
N$21
  Top 0.42: R11.2 VR11.1
N$23
  Top 0.42: R12.2 VR12.1
N$25
  Top 0.42: C5.1 R5.1
N$26
  Top 0.42: C6.1 R6.1
N$27
  Top 0.42: C7.1 R7.1
N$28
  Top 0.42: R7.2 VR7.1
N$29
  Top 0.42: R5.2 VR5.1
N$30
  Top 0.42: R6.2 VR6.1
N$31
  Top 0.42: C8.1 R8.1
N$32
  Top 0.42: R8.2 VR8.1
N$35
  Top 0.42: R14.1 C14.1
N$36
  Top 0.42: 109.18,44.17 R14.2 VR14.1
N$39
  Top 0.42: R15.1 C15.1
N$40
  Top 0.42: R16.1 C16.1
N$41
  Top 0.42: R17.1 C17.1
N$42
  Top 0.42: 109.18,16.23 R17.2 VR17.1
N$43
  Top 0.42: R15.2 VR15.1
N$44
  Top 0.42: VR16.1 R16.2
N$45
  Top 0.42: R18.1 C18.1
N$46
  Top 0.42: VR18.1 R18.2
OUTPUT_L  (via drill 0.35)
  Top 0.3: C23.- 77.34,92.71 72.14,87.5 56.4,87.5 v54.65,89.25 | v36.69,91.63 8.06,91.63 5.75,89.31 5.75,37.16 v6.38,36.52
  Bottom 0.3: v6.38,36.52 6.36,36.5 6.36,35.44 PORTBOARD.23 | v36.69,91.63 39.07,89.25 v54.65,89.25
OUTPUT_R  (via drill 0.35)
  Top 0.3: C22.- 87,85.72 51.69,85.72 49.79,87.63 v38.1,87.63 | PORTBOARD.24 11.65,33 14.4,30.25 18.15,30.25 18.15,47.75 19.77,49.37 22.48,49.37 23.54,50.43 23.54,52.73 29.9,59.09 29.9,85.9 31.89,87.88 v32,87.88
  Bottom 0.3: v38.1,87.63 32.26,87.63 v32,87.88
R_INPUT1
  Top 0.42: XPN1.12 C1.2
R_INPUT2
  Top 0.42: XPN2.12 C2.2
R_INPUT3
  Top 0.42: XPN3.12 C3.2
R_INPUT4
  Top 0.42: XPN4.12 C4.2
R_INPUT5
  Top 0.42: XPN5.12 C5.2
R_INPUT6
  Top 0.42: XPN6.12 C6.2
R_INPUT7
  Top 0.42: XPN7.12 C7.2
R_INPUT8
  Top 0.42: XPN8.12 C8.2
R_OP_IN
  Top 0.42: VR19.2 123.81,65.57 122.61,66.77 122.61,68 128.27,73.66 | 128.27,73.66 128.27,87.18 130.49,89.4 130.49,97.66 129.22,98.93 124.16,98.93 120.65,95.43 IC1.2 | VR2.2 92.71,70.36 96.01,73.66 128.27,73.66
  Bottom 0.42: VR9.2 VR8.2 VR7.2 VR6.2 VR5.2 VR4.2 VR3.2 VR2.2 VR1.2
RIGHT_OP_OUT
  Top 0.42: R19.2 115.57,92.71 IC1.1 123.06,100.2 129.41,100.2 131.19,98.42 131.19,88.97 129.05,86.82 129.05,73.43 123.81,68.19 VR19.1
ROTENC1_A  (via drill 0.35)
  Top 0.3: v31.15,53 29.4,51.25 29.4,40.75 20.4,40.75 TEENSY_3.6.28
  Bottom 0.3: v31.15,53 32.9,54.75 40.9,54.75 43.15,57 KNOBBOARD.1
ROTENC1_B  (via drill 0.35)
  Top 0.3: v38.15,39.5 38.15,49.5 39.4,50.75 39.4,55.75 42.4,58.75 46.4,58.75 46.9,58.25 46.9,56.75 45.9,55.75 44.32,55.75 KNOBBOARD.3
  Bottom 0.3: v38.15,39.5 35.4,39.5 34.4,38.5 20.65,38.5 20.4,38.25 TEENSY_3.6.29
ROTENC2_A  (via drill 0.35)
  Top 0.3: v37.4,38.25 37.4,49.75 v38.65,51
  Bottom 0.3: v37.4,38.25 36.15,37 21.65,37 20.4,35.75 TEENSY_3.6.30 | v38.65,51 39.65,52 43.15,52 KNOBBOARD.5
ROTENC2_B  (via drill 0.35)
  Top 0.3: v34.9,52 34.4,51.5 34.4,46.75 35.4,45.75 TEENSY_3.6.39/A20
  Bottom 0.3: v34.9,52 36.65,52 38.9,49.75 43.15,49.75 KNOBBOARD.7
ROTENC3_A  (via drill 0.35)
  Top 0.3: v38.9,44.75 39.9,45.75 39.9,55.5 42.65,58.25 44.95,58.25 KNOBBOARD.2
  Bottom 0.3: v38.9,44.75 37.15,44.75 35.65,43.25 TEENSY_3.6.38/A19
ROTENC3_B
  Top 0.3: TEENSY_3.6.37/A18 35.65,40.5 36.65,39.5 36.65,38 37.15,37.5 37.88,37.5 40.15,39.77 40.15,45.25 40.4,45.5 40.4,51 42.9,53.5 45.65,53.5 45.65,54.5 KNOBBOARD.4
ROTENC4_A
  Top 0.3: TEENSY_3.6.36/A17 35.65,38 36.65,37 38.14,37 41.4,40.26 41.4,49.5 42.9,51 45.65,51 45.65,52 KNOBBOARD.6
ROTENC4_B
  Top 0.3: TEENSY_3.6.35/A16 35.65,35.75 37.78,35.75 41.9,39.87 41.9,47.25 42.9,48.25 45.65,48.25 45.65,49.5 KNOBBOARD.8
SCR_BL  (via drill 0.35)
  Top 0.3: v14.65,72.75 14.65,73.25 13.65,73.25 SCR.29
  Bottom 0.3: v14.65,72.75 20.15,67.25 22.59,67.25 26.34,63.5 TEENSY_3.6.16/A2
SCR_CLK  (via drill 0.35)
  Top 0.3: v16.15,66 16.15,74.66 15.05,75.75 13.65,75.75 SCR.24
  Bottom 0.3: v16.15,66 20.15,62 29.4,62 35.4,56 TEENSY_3.6.13/SCK
SCR_CS  (via drill 0.35)
  Top 0.3: v16.9,64.25 16.9,74.67 15.32,76.25 13.65,76.25 SCR.23
  Bottom 0.3: v16.9,64.25 20.15,61 TEENSY_3.6.10/CS
SCR_DC  (via drill 0.35)
  Top 0.3: v15.4,68 15.53,68.13 15.53,74.52 14.79,75.25 13.65,75.25 SCR.25
  Bottom 0.3: v15.4,68 19.9,63.5 TEENSY_3.6.9/CS
SCR_MOSI  (via drill 0.35)
  Top 0.3: v16.65,62 12.4,66.25 12.4,74.25 13.4,74.25 SCR.27
  Bottom 0.3: v16.65,62 20.15,58.5 TEENSY_3.6.11/MOSI
SCR_MOSO  (via drill 0.35)
  Top 0.3: v14.65,74 14.65,73.75 13.65,73.75 SCR.28
  Bottom 0.3: v14.65,74 13.9,73.25 13.9,62.25 20.15,56 TEENSY_3.6.12/MISO
SDCLK  (via drill 0.35)
  Top 0.3: PORTBOARD.19 10.37,36.62 11.87,36.62 12.75,35.75 12.75,34.24 v13.97,33.02
  Bottom 0.3: SDPIN5.1 26.65,21.75 25.65,22.75 16.62,22.75 13.97,25.4 v13.97,33.02
SDCMD
  Bottom 0.3: PORTBOARD.20 11.65,38 11.65,37 16.15,32.5 16.15,29.75 16.84,29.06 26.62,29.06 29.15,26.53 29.15,21.75 SDPIN3.1
SDDATA0  (via drill 0.35)
  Top 0.3: v17.9,21.75 15.15,21.75 7.15,29.75 7.15,41.5 8.65,43 PORTBOARD.15
  Bottom 0.3: v17.9,21.75 23.9,21.75 SDPIN7.1
SDDATA1  (via drill 0.35)
  Top 0.3: v21.15,39.25 22.65,37.75 22.65,24.25 SDPIN8.1
  Bottom 0.3: v21.15,39.25 15.4,39.25 11.65,43 PORTBOARD.16
SDDATA2  (via drill 0.35)
  Top 0.3: v18.65,21 18.65,22.5 15.15,22.5 7.65,30 7.65,39.5 8.65,40.5 PORTBOARD.17
  Bottom 0.3: v18.65,21 20.67,18.98 29.13,18.98 31.65,21.5 SDPIN1.1
SDDATA3  (via drill 0.35)
  Top 0.3: v23.4,34.25 27.9,29.75 27.9,24.25 SDPIN2.1
  Bottom 0.3: v23.4,34.25 20.15,34.25 16.4,38 14.15,38 11.65,40.5 PORTBOARD.18
TEENSY_L  (via drill 0.35)
  Top 0.3: C18.2 97.79,2.54 69.85,2.54 69.65,2.5 40.9,2.5 18.65,24.75 18.65,43.5 v19.4,44.25
  Bottom 0.3: v19.4,44.25 31.4,44.25 35.4,48.25 TEENSY_3.6.21/DAC0
TEENSY_R
  Top 0.3: TEENSY_3.6.A22/DAC1 35.65,50.75 36.65,49.75 36.65,42.75 35.65,41.75 35.15,41.75 34.4,41 34.4,30 55.51,8.89 77.47,8.89 C9.2
USBDATA+
  Top 0.3: PORTBOARD.13 8.65,45.75 6.65,47.75 6.65,89.2 8.45,91 21.4,91 24.77,87.63 USBPIN+.1
USBDATA-
  Top 0.3: PORTBOARD.14 11.4,45.5 10.15,46.75 10.15,47 8.4,47 7.15,48.25 7.15,88.94 8.71,90.5 21.15,90.5 25.12,86.53 27,86.53 28.1,87.63 USBPIN-.1
XPN_CLK  (via drill 0.35)
  Top 0.3: 58.4,76.96 58.4,78.75 59.65,80 XPN1.4 | 59.9,16.75 XPN8.4 58.4,17.8 58.4,27.94 | 59.9,26.5 XPN7.4 58.42,27.94 58.4,27.94 | 59.9,44.25 XPN5.4 58.42,45.72 58.4,45.72 | 58.4,54.75 58.4,63.5 | 58.4,54.75 59.65,53.5 XPN4.4 | 59.65,62 XPN3.4 58.42,63.5 58.4,63.5 | 58.4,54.75 58.4,45.72 | 58.4,45.72 58.4,36.83 | 58.4,36.83 58.4,27.94 | XPN6.4 58.42,36.83 58.4,36.83 | 58.4,76.96 58.4,72.39 | 58.4,72.39 58.4,63.5 | XPN2.4 59.67,71.12 58.4,72.39 | v54.01,75.25 56.69,75.25 58.4,76.96
  Bottom 0.3: TEENSY_3.6.20/A6 36.15,74.25 39.49,74.25 41,75.76 53.38,75.76 53.88,75.25 v54.01,75.25
XPN_CS1  (via drill 0.35)
  Top 0.3: XPN1.10 67.15,80.25 64.4,83 51.75,83 v51.31,83.44
  Bottom 0.3: TEENSY_3.6.6 20.15,71.25 18.4,73 18.4,83.68 19.59,84.87 49.87,84.87 v51.31,83.44
XPN_CS2  (via drill 0.35)
  Top 0.3: v24.29,50.87 24.29,51.89 30.4,58 30.4,85.25 35.15,90 62.36,90 v63.08,89.28
  Bottom 0.3: v24.29,50.87 20.35,50.87 TEENSY_3.6.24 | v63.08,89.28 66.15,86.21 66.15,72.25 67.15,71.25 XPN2.10
XPN_CS3  (via drill 0.35)
  Top 0.3: TEENSY_3.6.25 20.33,48.25 22.85,48.25 25.9,51.3 25.9,52.75 30.9,57.75 30.9,81.28 | 30.9,81.5 30.9,81.28 | 67.4,62.25 XPN3.10 | 30.9,81.28 30.95,81.33 30.95,81.44 34.37,84.86 35.99,84.86 36.65,84.2 64.9,84.2 68.4,80.7 68.4,76.25 v68.58,76.07
  Bottom 0.3: v68.58,76.07 68.58,63.5 XPN3.10
XPN_CS4  (via drill 0.35)
  Top 0.3: v26.65,51 31.4,55.75 31.4,81.25 32.52,82.37 64.31,82.37 65.9,80.79 65.9,73.53 v65.01,72.64
  Bottom 0.3: v26.65,51 21.37,45.72 TEENSY_3.6.26 | v65.01,72.64 66.04,71.61 66.04,54.61 XPN4.10
XPN_CS5  (via drill 0.35)
  Top 0.3: TEENSY_3.6.27 20.15,43 19.15,42 19.15,25 38.9,5.25 65.32,5.25 v66.55,6.48 | v66.93,10.79 66.93,11.05 68.58,12.7 68.58,17.78 65.99,20.37 65.99,43.13 XPN5.10
  Bottom 0.3: v66.93,10.79 66.93,6.86 v66.55,6.48
XPN_CS6  (via drill 0.35)
  Top 0.3: TEENSY_3.6.15/A1 35.4,60.75 33.9,59.25 33.9,44 34.15,43.75 34.15,41.5 33.9,41.25 33.9,29.5 52.86,10.54 52.9,10.54 v54.53,8.9
  Bottom 0.3: XPN6.10 67.4,35.5 68.4,35.5 68.4,13.5 63.8,8.9 v54.53,8.9
XPN_CS7  (via drill 0.35)
  Top 0.3: v53.17,9.23 31.9,30.5 31.9,62 36.15,62 36.65,61.5 36.65,59.5 35.65,58.5 TEENSY_3.6.14/A0
  Bottom 0.3: v53.17,9.23 53.55,9.61 62.01,9.61 66.15,13.75 66.15,26.5 67.15,26.5 XPN7.10
XPN_CS8  (via drill 0.35)
  Top 0.3: v39.99,78.77 52.04,78.77 53.13,77.68 53.13,22.27 58.4,17 58.4,16.25 59.4,15.25 65.9,15.25 67.15,16.5 XPN8.10
  Bottom 0.3: v39.99,78.77 39.99,78.64 35.66,78.64 TEENSY_3.6.22/A8
XPN_MISO  (via drill 0.35)
  Top 0.3: v38.65,75 38.75,75.1 38.75,79.28 41.22,81.75 63.15,81.75 63.56,81.34 | 63.56,81.34 64.65,80.25 XPN1.8 64.65,80 | 63.56,81.34 63.5,81.28 63.5,72.39 | 63.5,72.39 63.5,63.5 | 63.5,63.5 63.5,54.61 | 63.5,54.61 63.5,45.72 | 63.5,45.72 63.5,36.83 | 63.5,36.83 63.5,27.94 | 63.5,27.94 63.5,17.78 XPN8.8 | XPN7.8 63.5,27.94 | XPN6.8 63.5,36.83 | XPN5.8 63.5,45.72 | XPN4.8 63.5,54.61 | XPN3.8 63.5,63.5 | XPN2.8 63.5,72.39
  Bottom 0.3: v38.65,75 35.4,75 34.15,73.75 20.4,73.75 TEENSY_3.6.5
XPN_MOSI  (via drill 0.35)
  Top 0.3: v53.76,78.48 56.52,81.25 60.99,81.25 | 62.15,53.5 XPN4.6 62.23,53.37 60.99,54.61 | XPN1.6 60.99,81.25 | 60.99,81.25 60.99,72.39 | 60.99,72.39 60.99,63.5 | 60.99,63.5 60.99,54.61 | 60.99,54.61 60.99,45.72 | 60.99,45.72 60.99,36.83 | 60.99,36.83 60.99,27.94 | 60.99,27.94 60.99,17.75 XPN8.6 | XPN7.6 62.23,26.7 60.99,27.94 | XPN6.6 62.23,35.59 60.99,36.83 | XPN5.6 62.23,44.48 60.99,45.72 | XPN3.6 62.23,62.26 60.99,63.5 | XPN2.6 62.23,71.15 60.99,72.39
  Bottom 0.3: v53.76,78.48 51.52,76.25 35.65,76.25 TEENSY_3.6.21/A7

### Text on the board
tPlace: L Gain Adj | R Gain Adj | 9 Channel Stereo Audio Mixer | Lynxwave ButtSeqs - 2025 / Teensy Main Connection PCB